# EAGLE design TCduo_v1 (EAGLE 9.6.2)
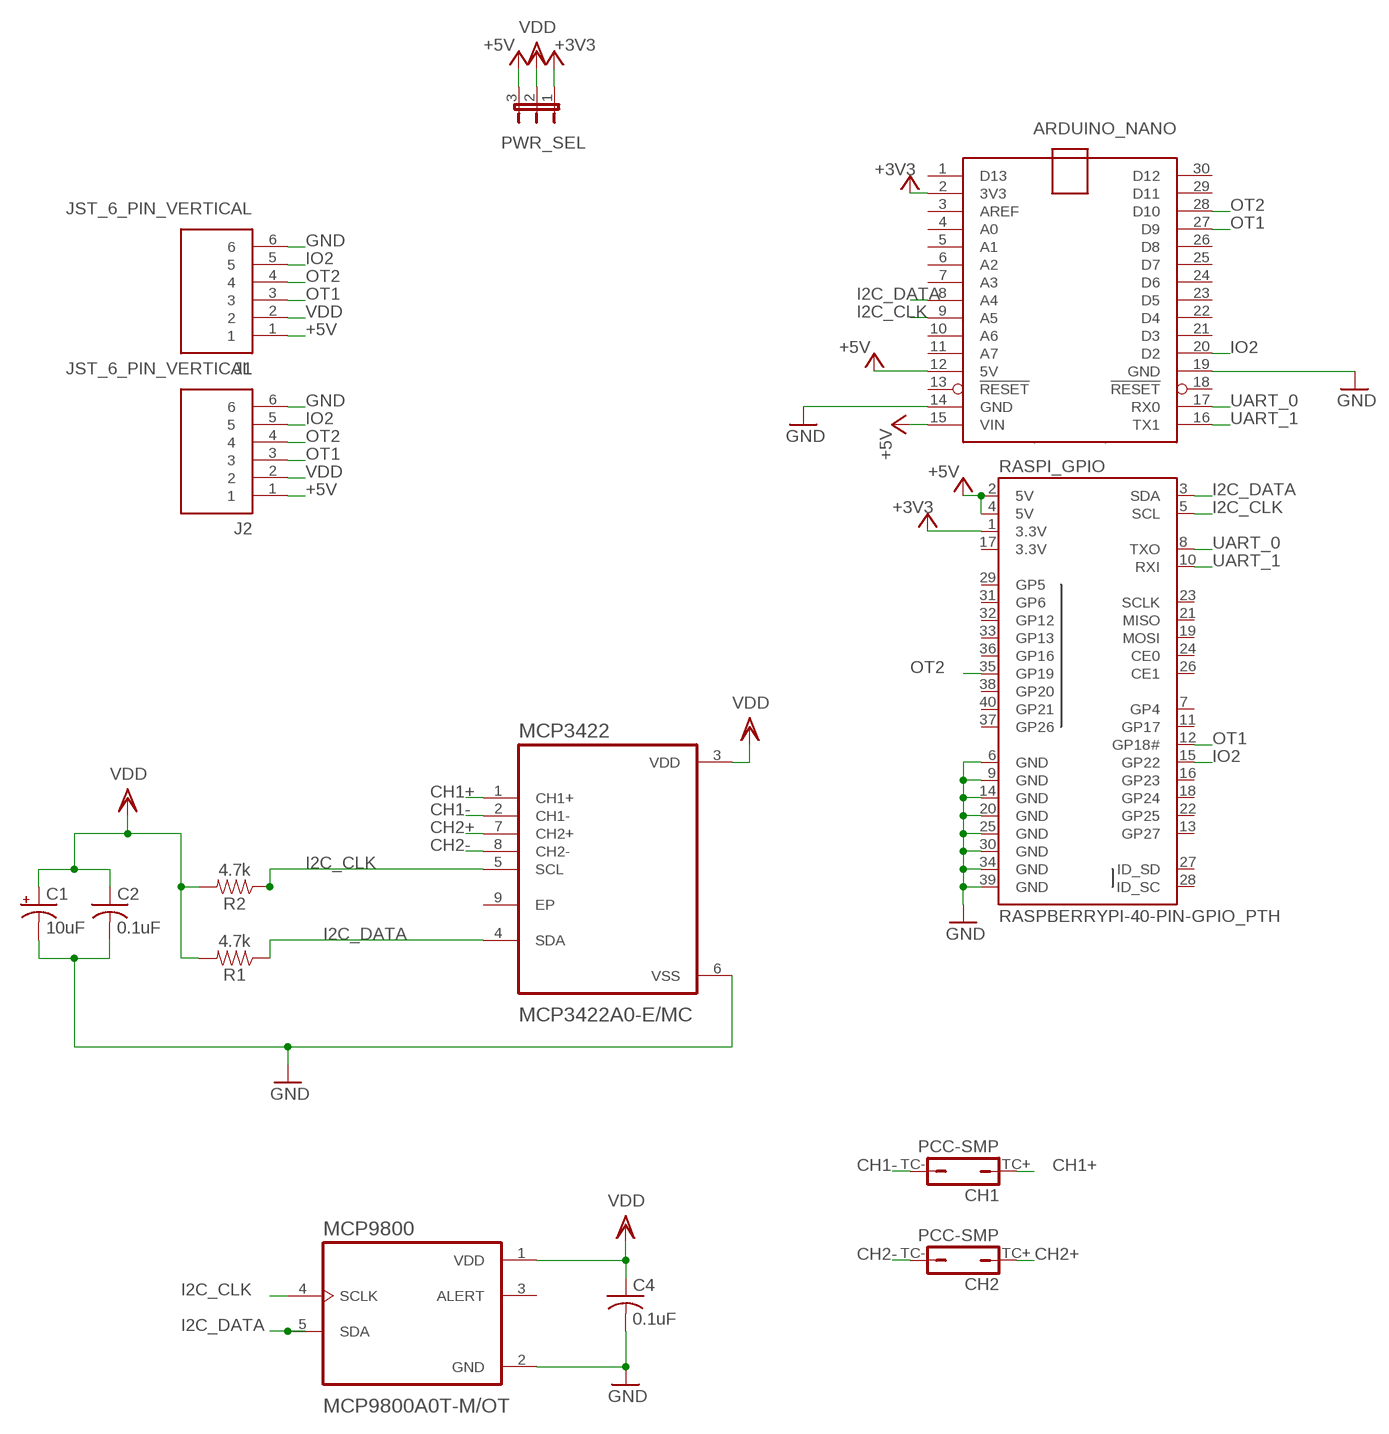
[diagram p0: schematic, sheet 1]

## Parts
ARDUINO_NANO  ARDUINO_NANO  [ARDUINO_NANO]
C1  10uF  10UF-POLAR-EIA3216-16V-10%(TANT)  [EIA3216]
C2  0.1uF  C-USC0805  [C0805]
C4  0.1uF  C-USC0805  [C0805]
CH1  PCC-SMP  [PCC-SMP]
CH2  PCC-SMP  [PCC-SMP]
J1  JST_6_PIN_VERTICAL  [JST-6-SMD-VERT-1.0MM]
J2  JST_6_PIN_VERTICAL  [JST-6-SMD-VERT-1.0MM]
MCP3422  MCP3422A0-E/MC  [SON50P200X300X100-9N]
MCP9800  MCP9800A0T-M/OT  [SOT95P270X145-5N]
PWR_SEL  JP2E  [JP2]
R1  4.7k  4.7KOHM-0603-1/10W-1%  [0603]
R2  4.7k  4.7KOHM-0603-1/10W-1%  [0603]
RASPI_GPIO  RASPBERRYPI-40-PIN-GPIO_PTH  [2X20_SHROUDED]

## Nets
+3V3: ARDUINO_NANO.2(3V3) PWR_SEL.1 RASPI_GPIO.1(3.3V)
+5V: ARDUINO_NANO.12(5V) ARDUINO_NANO.15(VIN) J1.1 J2.1 PWR_SEL.3 RASPI_GPIO.2(5V) RASPI_GPIO.4(5V)
CH1+: CH1.TC+ MCP3422.1(CH1+)
CH1-: CH1.TC- MCP3422.2(CH1-)
CH2+: CH2.TC+ MCP3422.7(CH2+)
CH2-: CH2.TC- MCP3422.8(CH2-)
GND: ARDUINO_NANO.14(GND) ARDUINO_NANO.19(GND) C1.- C2.2 C4.2 J1.6 J2.6 MCP3422.6(VSS) MCP9800.2(GND) RASPI_GPIO.6(GND) RASPI_GPIO.9(GND) RASPI_GPIO.14(GND) RASPI_GPIO.20(GND) RASPI_GPIO.25(GND) RASPI_GPIO.30(GND) RASPI_GPIO.34(GND) RASPI_GPIO.39(GND)
I2C_CLK: ARDUINO_NANO.9(A5) MCP3422.5(SCL) MCP9800.4(SCLK) R2.1 RASPI_GPIO.5(SCL)
I2C_DATA: ARDUINO_NANO.8(A4) MCP3422.4(SDA) MCP9800.5(SDA) R1.1 RASPI_GPIO.3(SDA)
IO2: ARDUINO_NANO.20(D2) J1.5 J2.5 RASPI_GPIO.15(GP22)
OT1: ARDUINO_NANO.27(D9) J1.3 J2.3 RASPI_GPIO.12(GP18#)
OT2: ARDUINO_NANO.28(D10) J1.4 J2.4 RASPI_GPIO.35(GP19)
UART_0: ARDUINO_NANO.17(RX0) RASPI_GPIO.8(TXO)
UART_1: ARDUINO_NANO.16(TX1) RASPI_GPIO.10(RXI)
VDD: C1.+ C2.1 C4.1 J1.2 J2.2 MCP3422.3(VDD) MCP9800.1(VDD) PWR_SEL.2 R1.2 R2.2
Unconnected: ARDUINO_NANO.1(D13) ARDUINO_NANO.3(AREF) ARDUINO_NANO.4(A0) ARDUINO_NANO.5(A1) ARDUINO_NANO.6(A2) ARDUINO_NANO.7(A3) ARDUINO_NANO.10(A6) ARDUINO_NANO.11(A7) ARDUINO_NANO.13(!RESET) ARDUINO_NANO.18(!RESET) ARDUINO_NANO.21(D3) ARDUINO_NANO.22(D4) ARDUINO_NANO.23(D5) ARDUINO_NANO.24(D6) ARDUINO_NANO.25(D7) ARDUINO_NANO.26(D8) ARDUINO_NANO.29(D11) ARDUINO_NANO.30(D12) MCP3422.9(EP) MCP9800.3(ALERT) RASPI_GPIO.7(GP4) RASPI_GPIO.11(GP17) RASPI_GPIO.13(GP27) RASPI_GPIO.16(GP23) RASPI_GPIO.18(GP24) RASPI_GPIO.19(MOSI) RASPI_GPIO.21(MISO) RASPI_GPIO.22(GP25) RASPI_GPIO.23(SCLK) RASPI_GPIO.24(CE0) RASPI_GPIO.26(CE1) RASPI_GPIO.27(ID_SD) RASPI_GPIO.28(ID_SC) RASPI_GPIO.29(GP5) RASPI_GPIO.31(GP6) RASPI_GPIO.32(GP12) RASPI_GPIO.33(GP13) RASPI_GPIO.36(GP16) RASPI_GPIO.37(GP26) RASPI_GPIO.38(GP20) RASPI_GPIO.40(GP21)

## Power pins joined to a net without a drawn wire
3.3V: RASPI_GPIO.17(3.3V)

## Library data of the parts
ARDUINO_NANO = ArduinoNanoV30:ARDUINO_NANO: Arduino Nano V3.0 Overview: The Arduino Nano is a small, complete, and breadboard-friendly board based on the ATmega328 (Arduino Nano 3.x) or ATmega168 (Arduino Nano 2.x). It has more or less the same functionality of the Arduino Duemilanove, but in a different package. It lacks only a DC power jack, and works with a Mini-B USB cable instead of a standard one. The Nano was designed and is being produced by Gravitech. Specifications: Microcontroller Atmel ATmega168 or ATmega328 Operating Voltage (logic level) 5 V Input Voltage (recommended) 7-12 V Input Voltage (limits) 6-20 V Digital I/O Pins 14 (of which 6 provide PWM output) Analog Input Pins 8 DC Current per I/O Pin 40 mA Flash Memory 16 KB (ATmega168) or 32 KB (ATmega328) of which 2 KB used by bootloader SRAM 1 KB (ATmega168) or 2 KB (ATmega328) EEPROM 512 bytes (ATmega168) or 1 KB (ATmega328) Clock Speed 16 MHz Dimensions 0.73" x 1.70" Length 45 mm Width 18 mm Weigth 5 g Power: The Arduino Nano can be powered via the Mini-B USB connection, 6-20V unregulated external power supply (pin 30), or 5V regulated external power supply (pin 27). The power source is automatically selected to the highest voltage source. Memory: The ATmega168 has 16 KB of flash memory for storing code (of which 2 KB is used for the bootloader); the ATmega328 has 32 KB, (also with 2 KB used for the bootloader). The ATmega168 has 1 KB of SRAM and 512 bytes of EEPROM (which can be read and written with the EEPROM library); the ATmega328 has 2 KB of SRAM and 1 KB of EEPROM. Input and Output: Each of the 14 digital pins on the Nano can be used as an input or output, using pinMode(), digitalWrite(), and digitalRead() functions. They operate at 5 volts. Each pin can provide or receive a maximum of 40 mA and has an internal pull-up resistor (disconnected by default) of 20-50 kOhms. In addition, some pins have specialized functions. Visit Arduino - ArduinoBoardNano <https://www.arduino.cc/en/Main/ArduinoBoardNano>
C1 = SparkFun-Capacitors:10UF-POLAR: 10.0µF polarized capacitors A capacitor is a passive two-terminal electrical component used to store electrical energy temporarily in an electric field.; PROD_ID: CAP-00811
C2 C4 = adafruit:C-US: CAPACITOR, American symbol
CH1 CH2 = PCC-SMP:PCC-SMP
J1 J2 = SparkFun-Connectors:JST_6_PIN_VERTICAL: JST 6 pin vertical connector Here is a six pin vertical 1.0mm pitch connector. It is useful if you need something very tiny as a connection. These are not the standard JST type connectors we use on most of our boards, but are actually the much smaller JST-SH type. Here is the connector we sell at SparkFun: JST SH Vertical 6-Pin Connector - SMD <https://www.sparkfun.com/products/579> (GPS-00579) Datasheet <http://www.sparkfun.com/datasheets/GPS/EM406-SMDConnector-eSH.pdf> It was used on these SparkFun products: SparkFun GPS Breakout <https://www.sparkfun.com/products/11818> (BOB-11818) SparkFun Weather Shield <https://www.sparkfun.com/products/12081> (DEV-12081) And many, many other GPS related products.; PROD_ID: CONN-08249; SF_ID: GPS-00579
MCP3422 = MCP3422A0-E_MC:MCP3422A0-E/MC; DESCRIPTION: 18 Bit Analog to Digital Converter 2 Input 1 Sigma-Delta 8-DFN (2x3); DIGI-KEY_PART_NUMBER: MCP3422A0-E/MC-ND; MF: Microchip; MP: MCP3422A0-E/MC; PACKAGE: DFN-8 Microchip; PURCHASE-URL: https://pricing.snapeda.com/search/part/MCP3422A0-E/MC/?ref=eda
MCP9800 = MCP9800A0T-M_OT:MCP9800A0T-M/OT; DESCRIPTION: Temperature Sensor Digital, Local -55°C ~ 125°C 11 b SOT-23-5; DIGI-KEY_PART_NUMBER: MCP9800A0T-M/OTCT-ND; MF: Microchip; MP: MCP9800A0T-M/OT; PACKAGE: SOT-23-5 Microchip; PURCHASE-URL: https://pricing.snapeda.com/search/part/MCP9800A0T-M/OT/?ref=eda
PWR_SEL = jumper-piTC:JP2E: JUMPER
R1 R2 = SparkFun-Resistors:4.7KOHM: 4.7kΩ resistor A resistor is a passive two-terminal electrical component that implements electrical resistance as a circuit element. Resistors act to reduce current flow, and, at the same time, act to lower voltage levels within circuits. - Wikipedia; PROD_ID: RES-07857
RASPI_GPIO = SparkFun-Connectors:RASPBERRYPI-40-PIN-GPIO: Raspberry Pi GPIO Header 2x20 pin connector, as found on B, B+, A+ models. Both shrouded PTH and SMT versions available. SparkFun Products: GPIO Shrouded Header <https://www.sparkfun.com/products/13054>- PTH SparkFun Pi Wedge (Preassembled) <https://www.sparkfun.com/products/13717>; PROD_ID: CONN-12263; SF_ID: PRT-13054

## Net classes
0 default: width 0.305 mm, drill 0.127 mm, clearance 0.203 mm
1 DC: width 0.61 mm, drill 0.254 mm, clearance 0.406 mm
2 AC: width 5.08 mm, drill 0.305 mm, clearance 5.08 mm
3 Hole: drill 2.05 mm, clearance 4.8 mm

## Board
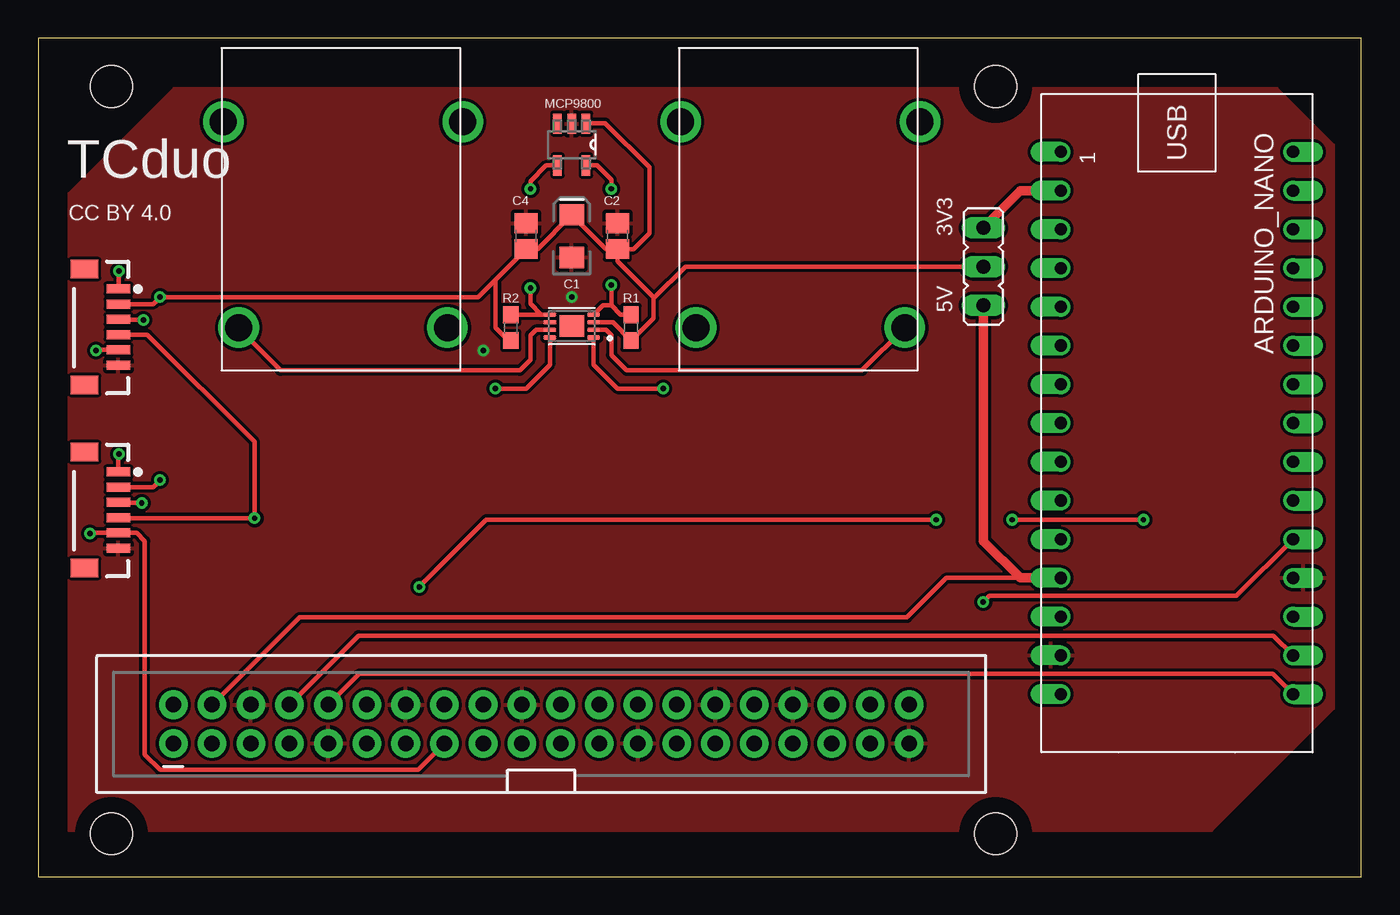
[diagram p1: board, top side]
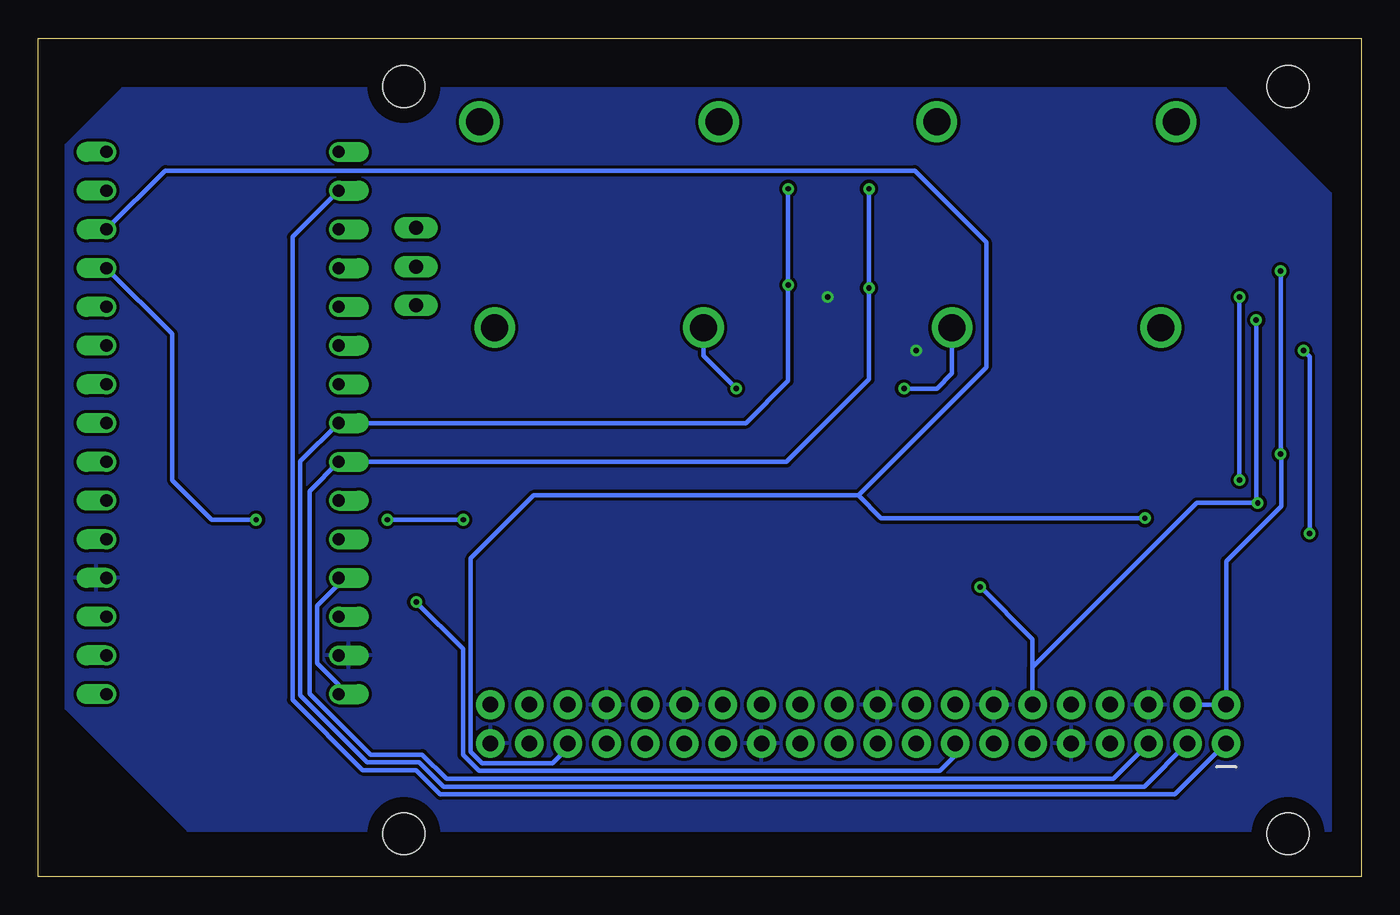
[diagram p2: board, bottom side, seen from below]

Size 86.8 x 54.98 mm. Coordinates in mm from the lower left corner, seen from the top.
Outline: 0,0 86.8,0 86.8,54.98 0,54.98 0,0
Copper layers (1*16): Top 0.035mm / dielectric 1.5mm / Bottom 0.035mm
Design rules "default": minimum track width 6mil, minimum drill 0.35mm, track to track 6mil, track to pad 6mil, pad to pad 6mil, via to via 6mil, smd to smd 6mil, copper to edge 40mil, drill to drill 6mil, minimum pad ring 10mil, minimum via ring 8mil, stop-mask expansion 4mil, vias tented up to drill 0mil, thermal gap 10mil
Holes 2.75 mm at 4.81,2.81 4.81,51.81 62.81,2.81 62.81,51.81

### Footprints (pad centres in the part's own frame; a part is rotated, then mirrored left to right if it is on the bottom)
ARDUINO_NANO = drill 0.8 offset: 1 -20.32,-7.62; 2 -17.78,-7.62; 3 -15.24,-7.62; 4 -12.7,-7.62; 5 -10.16,-7.62; 6 -7.62,-7.62; 7 -5.08,-7.62; 8 -2.54,-7.62; 9 0,-7.62; 10 2.54,-7.62; 11 5.08,-7.62; 12 7.62,-7.62; 13 10.16,-7.62; 14 12.7,-7.62; 15 15.24,-7.62; 16 15.24,7.62; 17 12.7,7.62; 18 10.16,7.62; 19 7.62,7.62; 20 5.08,7.62; 21 2.54,7.62; 22 0,7.62; 23 -2.54,7.62; 24 -5.08,7.62; 25 -7.62,7.62; 26 -10.16,7.62; 27 -12.7,7.62; 28 -15.24,7.62; 29 -17.78,7.62; 30 -20.32,7.62
EIA3216 = smd 1.4 x 1.6: + 1.4,0; - -1.4,0
C0805 = smd 1.3 x 1.5: 1 -0.85,0; 2 0.85,0
PCC-SMP = drill 1.778: CLIP0 7.85,13.5; CLIP1 -7.85,13.5; TC+ -6.85,0; TC- 6.85,0
JST-6-SMD-VERT-1.0MM = smd 0.6 x 1.55: 1 -2.54,1.27; 2 -1.54,1.27; 3 -0.54,1.27; 4 0.46,1.27; 5 1.46,1.27; 6 2.46,1.27 | smd 1.2 x 1.8: P$1 -3.84,-0.955; P$2 3.76,-0.955
SON50P200X300X100-9N = smd 0.84 x 0.27: 1 -1.435,0.75; 2 -1.435,0.25; 3 -1.435,-0.25; 4 -1.435,-0.75; 5 1.435,-0.75; 6 1.435,-0.25; 7 1.435,0.25; 8 1.435,0.75 | smd 1.625 x 1.425: 9 0,0
SOT95P270X145-5N = smd 1.321 x 0.559: 1 -1.372,0.94; 2 -1.372,0; 3 -1.372,-0.94; 4 1.372,-0.94; 5 1.372,0.94
JP2 = drill 0.914 long: 1 -2.54,0; 2 0,0; 3 2.54,0
0603 = smd 1.1 x 1: 1 -0.85,0; 2 0.85,0
2X20_SHROUDED = drill 1.016 pad 1.88: 1 -1.27,24.13; 2 1.27,24.13; 3 -1.27,21.59; 4 1.27,21.59; 5 -1.27,19.05; 6 1.27,19.05; 7 -1.27,16.51; 8 1.27,16.51; 9 -1.27,13.97; 10 1.27,13.97; 11 -1.27,11.43; 12 1.27,11.43; 13 -1.27,8.89; 14 1.27,8.89; 15 -1.27,6.35; 16 1.27,6.35; 17 -1.27,3.81; 18 1.27,3.81; 19 -1.27,1.27; 20 1.27,1.27; 21 -1.27,-1.27; 22 1.27,-1.27; 23 -1.27,-3.81; 24 1.27,-3.81; 25 -1.27,-6.35; 26 1.27,-6.35; 27 -1.27,-8.89; 28 1.27,-8.89; 29 -1.27,-11.43; 30 1.27,-11.43; 31 -1.27,-13.97; 32 1.27,-13.97; 33 -1.27,-16.51; 34 1.27,-16.51; 35 -1.27,-19.05; 36 1.27,-19.05; 37 -1.27,-21.59; 38 1.27,-21.59; 39 -1.27,-24.13; 40 1.27,-24.13

### Placement (x,y rotation side)
ARDUINO_NANO  74.7,27.2 270 top
C1  35,42 90 top
C2  38,42 90 top
C4  32,42 90 top
CH1  50,36 0 top
CH2  20,36 0 top
J1  4,36 270 top
J2  4,24 270 top
MCP3422  35,36.1 180 top
MCP9800  35,48 270 top
PWR_SEL  62,40 270 top
R1  38.9,36 270 top
R2  31,36 270 top
RASPI_GPIO  33,10 90 top

### Tracks (layer width: path | path; a pad name or v marks a point on that pad's centre or on a via)
+3V3
  Top 0.61: PWR_SEL.1 64.44,44.98 ARDUINO_NANO.2
  Bottom 0.305: RASPI_GPIO.1 12.22,5.38 60.42,5.38 62.02,6.98 65.5,6.98 70.11,11.59 70.11,41.95 ARDUINO_NANO.2
+5V  (via drill 0.35)
  Top 0.305: v5.3,27.7 5.27,27.67 J2.1 | v5.3,39.7 5.3,38.57 J1.1 | RASPI_GPIO.4 17.14,17 57,17 59.58,19.58 65,19.58
  Top 0.61: ARDUINO_NANO.12 65,19.58 64.42,19.58 62,22 PWR_SEL.3
  Bottom 0.305: ARDUINO_NANO.15 67.08,12.57 68.49,13.98 68.49,17.76 67.08,19.17 ARDUINO_NANO.12 | RASPI_GPIO.4 RASPI_GPIO.2 8.87,20.69 5.27,24.3 5.27,27.67 v5.3,27.7 v5.3,39.7
CH1+  (via drill 0.35)
  Top 0.305: MCP3422.1 36.44,33.56 38,32 v41,32
  Bottom 0.305: v41,32 43.15,34.15 CH1.TC+
CH1-
  Top 0.305: MCP3422.2 37.25,35.85 37.6,35.5 37.6,34.2 38.6,33.2 54.05,33.2 CH1.TC-
CH2+
  Top 0.305: MCP3422.7 32.65,35.85 32.3,35.5 32.3,33.9 31.6,33.2 15.9,33.2 13.15,35.95 CH2.TC+
CH2-  (via drill 0.35)
  Top 0.305: MCP3422.8 33.56,33.56 32,32 v30,32
  Bottom 0.305: v30,32 27.85,32 26.85,33 CH2.TC-
GND  (via drill 0.35)
  other vias: 35,38 29.2,34.5
  pour Top: 2,3 77,3 85,11 85,48 81.3,51.7 8.9,51.7 2,44.8
  pour Bottom: 2,3 77,3 85,11 85,48 81.3,51.7 8.9,51.7 2,44.8
I2C_CLK  (via drill 0.35)
  Top 0.305: MCP3422.5 33,36.85 | 33,36.85 R2.1 | v32.3,38.6 32.3,37.55 33,36.85 | v32.3,45.1 32.3,45.6 33.33,46.63 MCP9800.4
  Bottom 0.305: v32.3,45.1 v32.3,38.6 32.3,32.6 37.7,27.2 ARDUINO_NANO.9 69,25.28 69,12 65,8 61.6,8 60,6.4 16.28,6.4 RASPI_GPIO.5
I2C_DATA  (via drill 0.35)
  Top 0.305: v37.6,45.1 37.6,45.7 36.67,46.63 MCP9800.5 | v37.6,38.8 37.6,37.46 | MCP3422.4 37.04,37.46 37.6,37.46 | 37.6,37.46 38.21,36.85 R1.1
  Bottom 0.305: v37.6,45.1 v37.6,38.8 37.6,32.5 40.36,29.74 ARDUINO_NANO.8 69.6,27.22 69.6,11.88 65.21,7.49 61.81,7.49 60.21,5.89 14.25,5.89 RASPI_GPIO.3
IO2  (via drill 0.35)
  Top 0.305: v62,18 62.4,18.4 78.6,18.4 ARDUINO_NANO.20 | RASPI_GPIO.15 24.92,7 8,7 7,8 7,22 6.46,22.54 J2.5 3.44,22.54 v3.4,22.5 | v3.8,34.5 3.84,34.54 J1.5
  Bottom 0.305: v62,18 58.93,14.93 58.93,7.98 57.88,6.93 27.66,6.93 26.65,7.94 RASPI_GPIO.15 | v3.4,22.5 3.4,34.1 v3.8,34.5
OT1  (via drill 0.35)
  Top 0.305: v6.8,24.5 5.31,24.5 J2.3 | v6.9,36.5 5.31,36.5 J1.3 | v72.5,23.4 v63.9,23.4 | v58.9,23.4 29.4,23.4 v25,19
  Bottom 0.305: ARDUINO_NANO.27 78,35.58 78,26 75.4,23.4 v72.5,23.4 | RASPI_GPIO.12 21.57,13.73 | 21.57,13.73 10.8,24.5 v6.8,24.5 6.9,24.6 v6.9,36.5 | v63.9,23.4 v58.9,23.4 | v25,19 21.57,15.57 21.57,13.73
OT2  (via drill 0.35)
  Top 0.305: J2.4 5.31,23.5 v14.2,23.5 14.2,28.5 7.16,35.54 J1.4
  Bottom 0.305: RASPI_GPIO.35 52.05,8.44 53.05,7.43 57.67,7.43 58.42,8.19 58.42,20.88 54.3,25 33,25 | 33,25 24.6,33.4 24.6,41.6 29.3,46.3 78.46,46.3 ARDUINO_NANO.28 | 33,25 31.5,23.5 v14.2,23.5
UART_0
  Top 0.305: RASPI_GPIO.8 21.02,15.8 81.02,15.8 ARDUINO_NANO.17
UART_1
  Top 0.305: RASPI_GPIO.10 21.06,13.3 80.98,13.3 ARDUINO_NANO.16
VDD  (via drill 0.35)
  Top 0.305: C2.1 37.25,41.15 C1.+ 32.75,41.15 C4.1 | MCP3422.3 37.7,36.35 R1.2 40.38,36.62 40.38,37.92 40.4,37.95 | C2.1 38,40.35 40.4,37.95 | C4.1 30,39.15 30,36 30.85,35.15 R2.2 | C2.1 39.05,41.15 40.1,42.2 40.1,46.5 37.2,49.4 35.97,49.4 MCP9800.1 | 40.4,37.95 42.45,40 PWR_SEL.2 | C4.1 28.85,38 v8,38 7.54,37.54 J1.2 | v8,26 7.54,25.54 J2.2
  Bottom 0.305: v8,38 v8,26

### Text on the board
tNames: TCduo | CC BY 4.0
_tNames: 3V3 | 5V